# Altium project SoM BaseBoard Prototype V0.PrjPcb (part 2 of 2)

## Sheet Peripherals - MyoSensor.SchDoc
size 420 x 297 mm; SheetNumber: 6; SheetTotal: 7
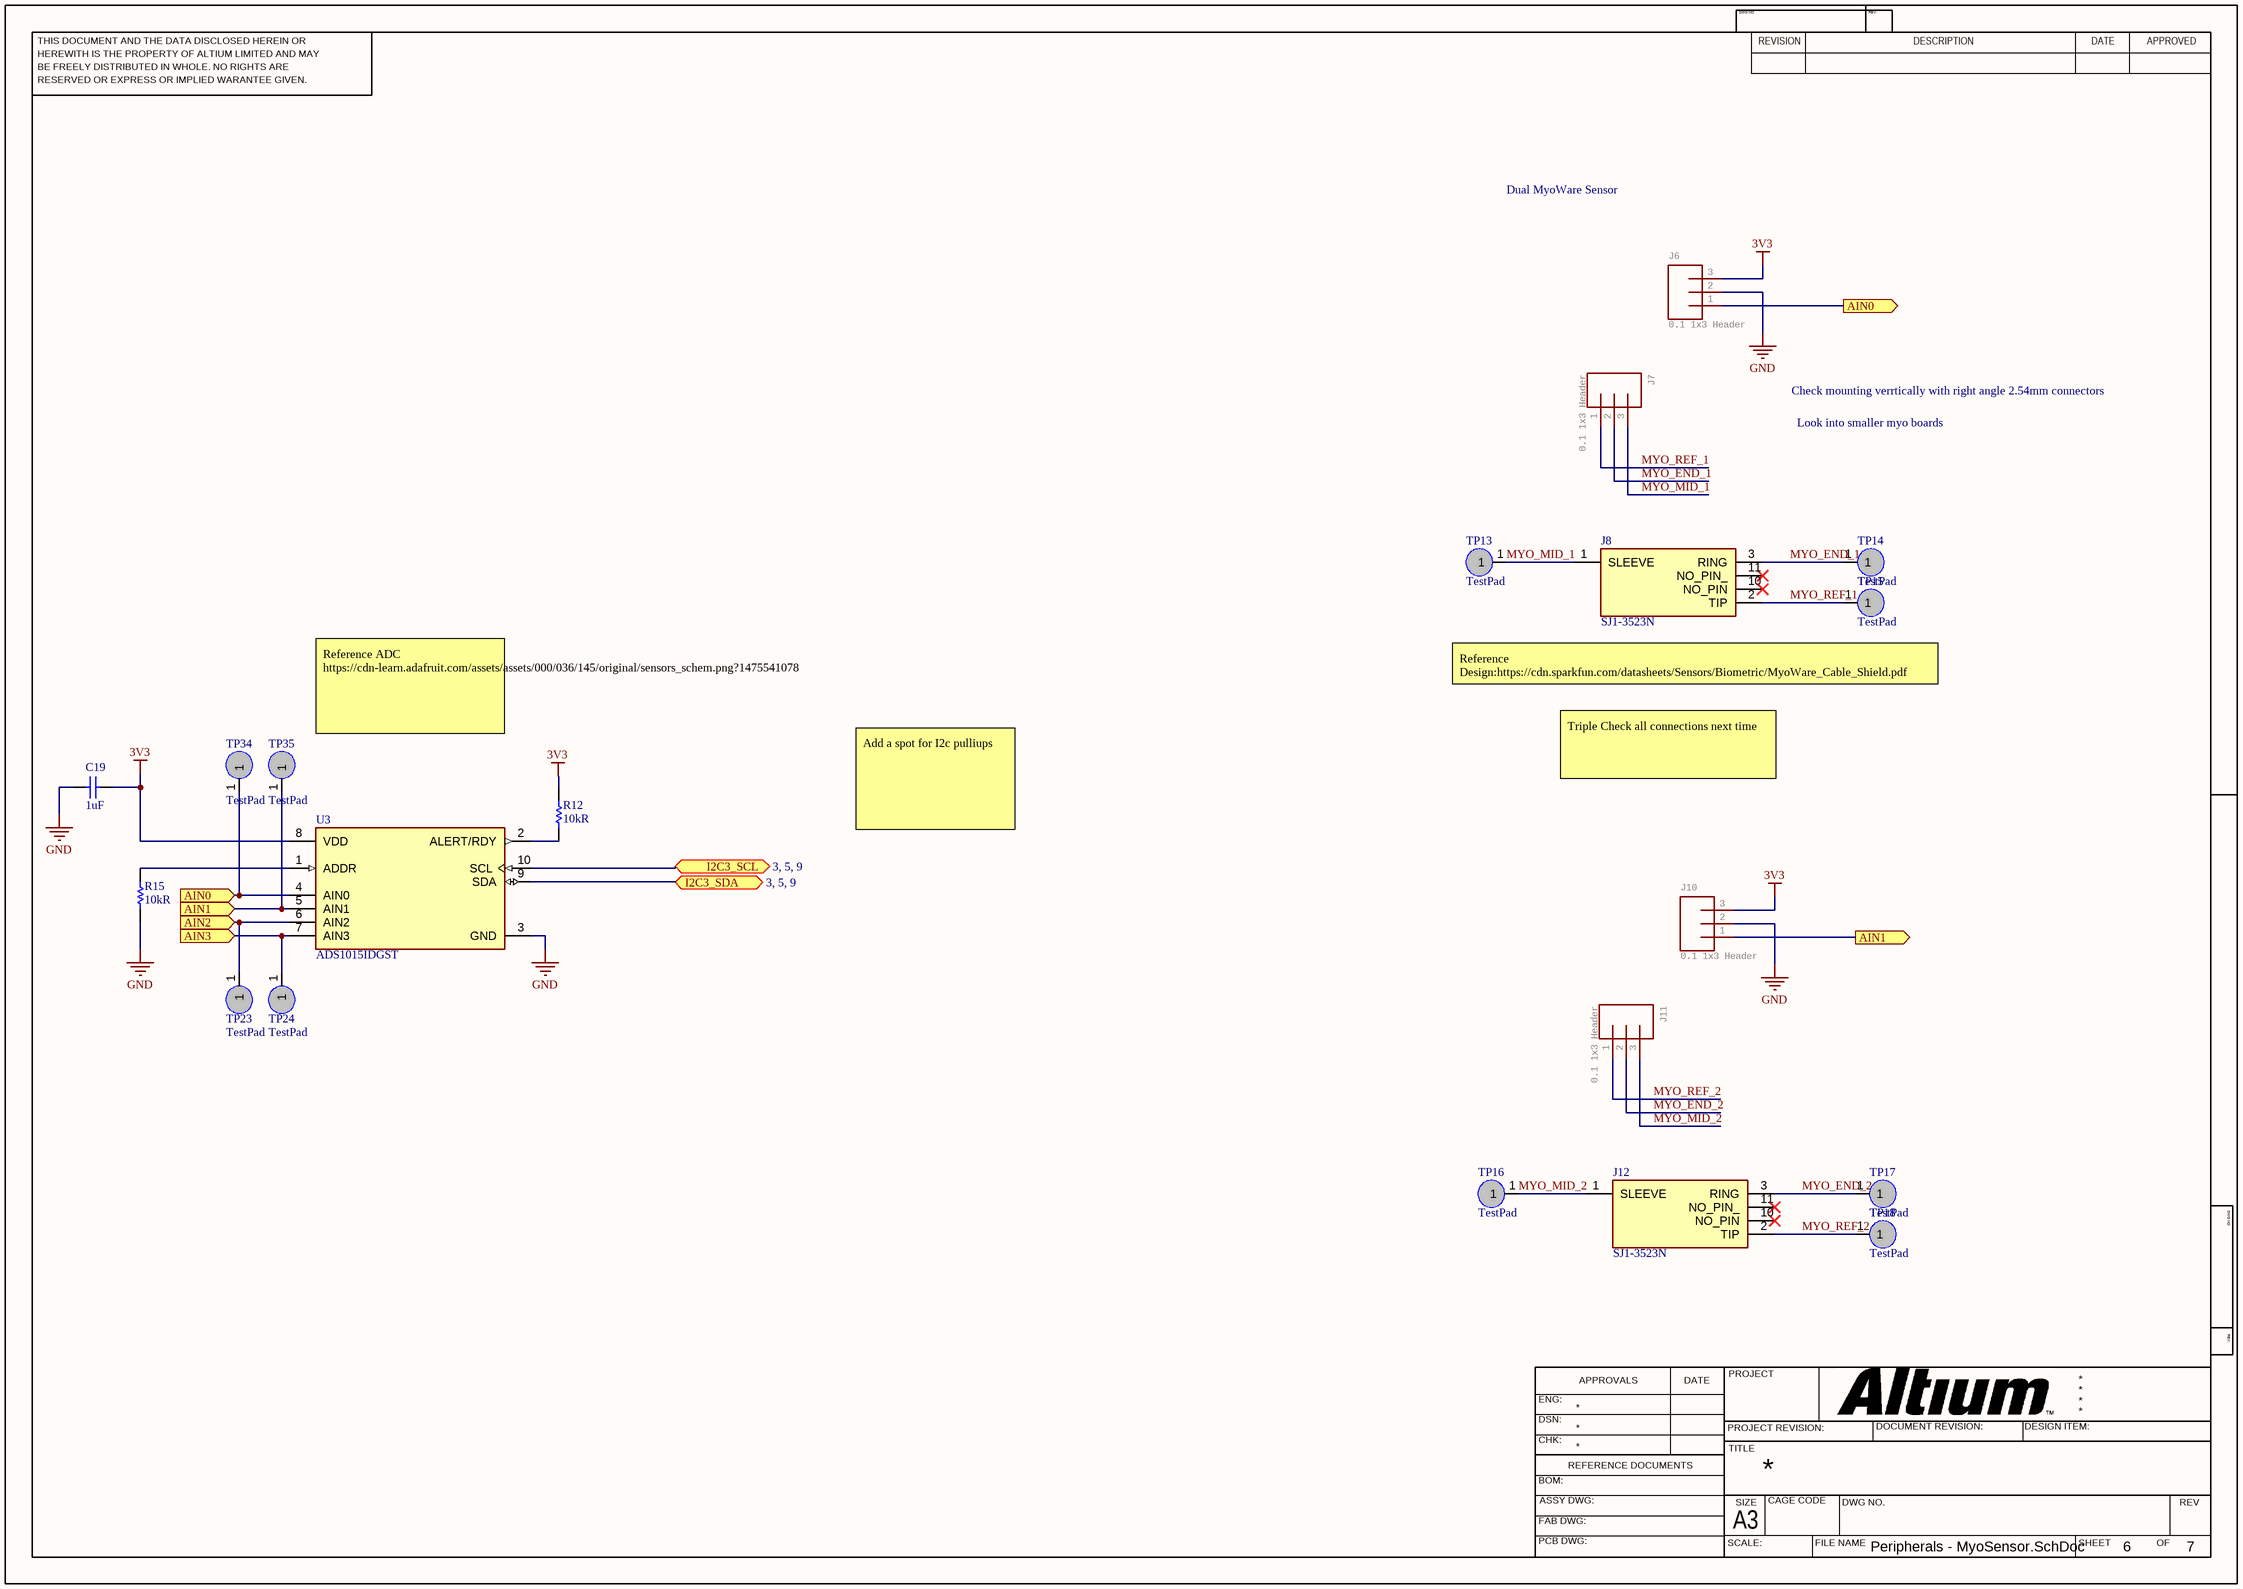
[diagram p5: Peripherals - MyoSensor.SchDoc]

### Parts
C19  1uF  [CAPC2013X145X50LL20T25]
J6  0.1 1x3 Header  [1X03]
J7  0.1 1x3 Header  [1X03]
J8  SJ1-3523N  [SJ13523N]
J10  0.1 1x3 Header  [1X03]
J11  0.1 1x3 Header  [1X03]
J12  SJ1-3523N  [SJ13523N]
R12  10kR  [RESC2013X60X35NL10T20]
R15  10kR  [RESC2013X60X35NL10T20]
TP13  TestPad  [TestPad50mil]
TP14  TestPad  [TestPad50mil]
TP15  TestPad  [TestPad50mil]
TP16  TestPad  [TestPad50mil]
TP17  TestPad  [TestPad50mil]
TP18  TestPad  [TestPad50mil]
TP23  TestPad  [TestPad50mil]
TP24  TestPad  [TestPad50mil]
TP34  TestPad  [TestPad50mil]
TP35  TestPad  [TestPad50mil]
U3  ADS1015IDGST  [FP-DGS0010A-MFG]

### Ports
AIN0 (in), AIN0 (out), AIN1 (in), AIN1 (out), AIN2 (in), AIN3 (in), I2C3_SCL (bidir, see 3, 5, 9), I2C3_SDA (bidir, see 3, 5, 9)

### Nets
3V3: C19.2 J6.3 J10.3 R12.2 U3.8(VDD)
GND: C19.1 J6.2 J10.2 R15.1 U3.3(GND)
I2C3_SCL: U3.10(SCL) ; port I2C3_SCL
I2C3_SDA: U3.9(SDA) ; port I2C3_SDA
MYO_END_1: J7.2 J8.3(RING) TP14.1
MYO_END_2: J11.2 J12.3(RING) TP17.1
MYO_MID_1: J7.3 J8.1(SLEEVE) TP13.1
MYO_MID_2: J11.3 J12.1(SLEEVE) TP16.1
MYO_REF_1: J7.1 J8.2(TIP) TP15.1
MYO_REF_2: J11.1 J12.2(TIP) TP18.1
NetJ6_1: J6.1 TP34.1 U3.4(AIN0) ; port AIN0
NetJ10_1: J10.1 TP35.1 U3.5(AIN1) ; port AIN1
NetR12_1: R12.1 U3.2(ALERT/RDY)
NetR15_2: R15.2 U3.1(ADDR)
NetTP23_1: TP23.1 U3.6(AIN2) ; port AIN2
NetTP24_1: TP24.1 U3.7(AIN3) ; port AIN3

Not connected (* = marked no-connect by the designer): J8 10(NO_PIN)* 11(NO_PIN_)*; J12 10(NO_PIN)* 11(NO_PIN_)*

### Notes on the sheet
- Dual MyoWare Sensor
- Check mounting verrtically with right angle 2.54mm connectors
- Look into smaller myo boards
- Reference ADC
  https://cdn-learn.adafruit.com/assets/assets/000/036/145/original/sensors_schem.png?1475541078
- Reference Design:https://cdn.sparkfun.com/datasheets/Sensors/Biometric/MyoWare_Cable_Shield.pdf
- Triple Check all connections next time
- Add a spot for I2c pulliups
- THIS DOCUMENT AND THE DATA DISCLOSED HEREIN OR
- HEREWITH IS THE PROPERTY OF ALTIUM LIMITED AND MAY
- DWG NO:
- REVISION
- REV:
- DESCRIPTION
- DATE
- APPROVED
- BE FREELY DISTRIBUTED IN WHOLE. NO RIGHTS ARE
- RESERVED OR EXPRESS OR IMPLIED WARANTEE GIVEN.
- ENG:
- APPROVALS
- PROJECT
- DSN:
- CHK:
- REFERENCE DOCUMENTS
- PROJECT REVISION:
- TITLE
- DOCUMENT REVISION:
- DESIGN ITEM:
- BOM:
- FAB DWG:
- PCB DWG:
- ASSY DWG:
- SCALE:
- A3
- SIZE
- CAGE CODE
- FILE NAME
- DWG NO.
- SHEET
- OF
- REV

### Library data of the parts
C19 = CMP-1036-04746-2: C0805C105K4PACTU; Manufacturer: Kemet; Part Number: C0805C105K4PACTU
J6 J7 J10 J11 = CONN_03: GateName_1: J$1; PROD_ID: XXX-00000; SymbolName_1: CONN_03; LibraryName: SparkFun-Connectors; DeviceSetName: CONN_03; Package: 1X03
J8 J12 = SJ1-3523N: Connector; Manufacturer_Name: CUI Inc.; Datasheet Link: https://componentsearchengine.com/Datasheets/1/SJ1-3523N.pdf; Height: 5.5mm; Manufacturer_Part_Number: SJ1-3523N; Mouser Part Number: 490-SJ1-3523N; Mouser Price/Stock: https://www.mouser.co.uk/ProductDetail/CUI-Devices/SJ1-3523N?qs=WyjlAZoYn50aNl0vAhb3Tg%3D%3D; Arrow Part Number: SJ1-3523N; Arrow Price/Stock: https://www.arrow.com/en/products/sj1-3523n/cui-devices
R12 R15 = CMP-1659-00013-4: RC0805FR-0710KL Chip Resistor, 10 KOhm, +/- 1%, 0.125 W, -55 to 155 degC, 0805 (2012 Metric), RoHS, Tape and Reel; Manufacturer: Yageo; Voltage Rating: 150 V; Mount: Surface Mount; ComponentLink1Description: Manufacturer URL; ComponentLink2URL: http://www.yageo.com/documents/recent/PYu-RC_Group_51_RoHS_L_04.pdf; Pins: 2; Length: 2 mm; Min Operating Temperature: -55 degC; Height: 0.5 mm; Mounting Technology: Surface Mount; RoHSCompliant: true; REACH SVHC: No SVHC; ComponentLink1URL: http://www.yageo.com/; Max Operating Temperature: 155 degC; PackageReference: 0805; DatasheetVersion: Rev. 4, 02/2016; Package Quantity: 5000; Packaging: Tape and Reel; ComponentLink2Description: Datasheet; PackageDescription: 2-Pin Surface Mounted Device, Body 2 x 1.25 mm
U3 = CMP-0003-00377-3: IC ADC 12BIT SIGMA-DELTA 10VSSOP; Supply Type: Single; Number of Converters: 1; Number of Bits: 12; Number of Inputs: 4; Sampling Rate: 3.3KS/s; Conversion Rate: 3300S/s; Min Supply Voltage: 2V; Interface: I2C; Operating Supply Voltage: 3.3V; Polarity: Bipolar; Nominal Supply Current: 150uA; Integral Nonlinearity (INL): 0.5LSB; Max Power Dissipation: 900uW; Max Supply Voltage (DC): 5.5V; Resolution: 12b; Width: 3mm; Min Operating Temperature: -40°C; Contact Plating: Gold; Number of A/D Converters: 1; Max Operating Temperature: 125°C; Height: 1.02mm; Case/Package: VSSOP; Package Quantity: 250; Number of Elements: 1; Lead Free: Lead Free; Number of Pins: 10; Radiation Hardening: No; Termination: SMD/SMT; Length: 3mm; Min Supply Voltage (DC): 2V; Power Dissipation: 900uW; Number of Channels: 4; Max Supply Voltage: 5.5V; REACH SVHC: No SVHC; Packaging: Tape and Reel

## Sheet Peripherals - Servos.SchDoc
size 420 x 297 mm; SheetNumber: 7; SheetTotal: 7
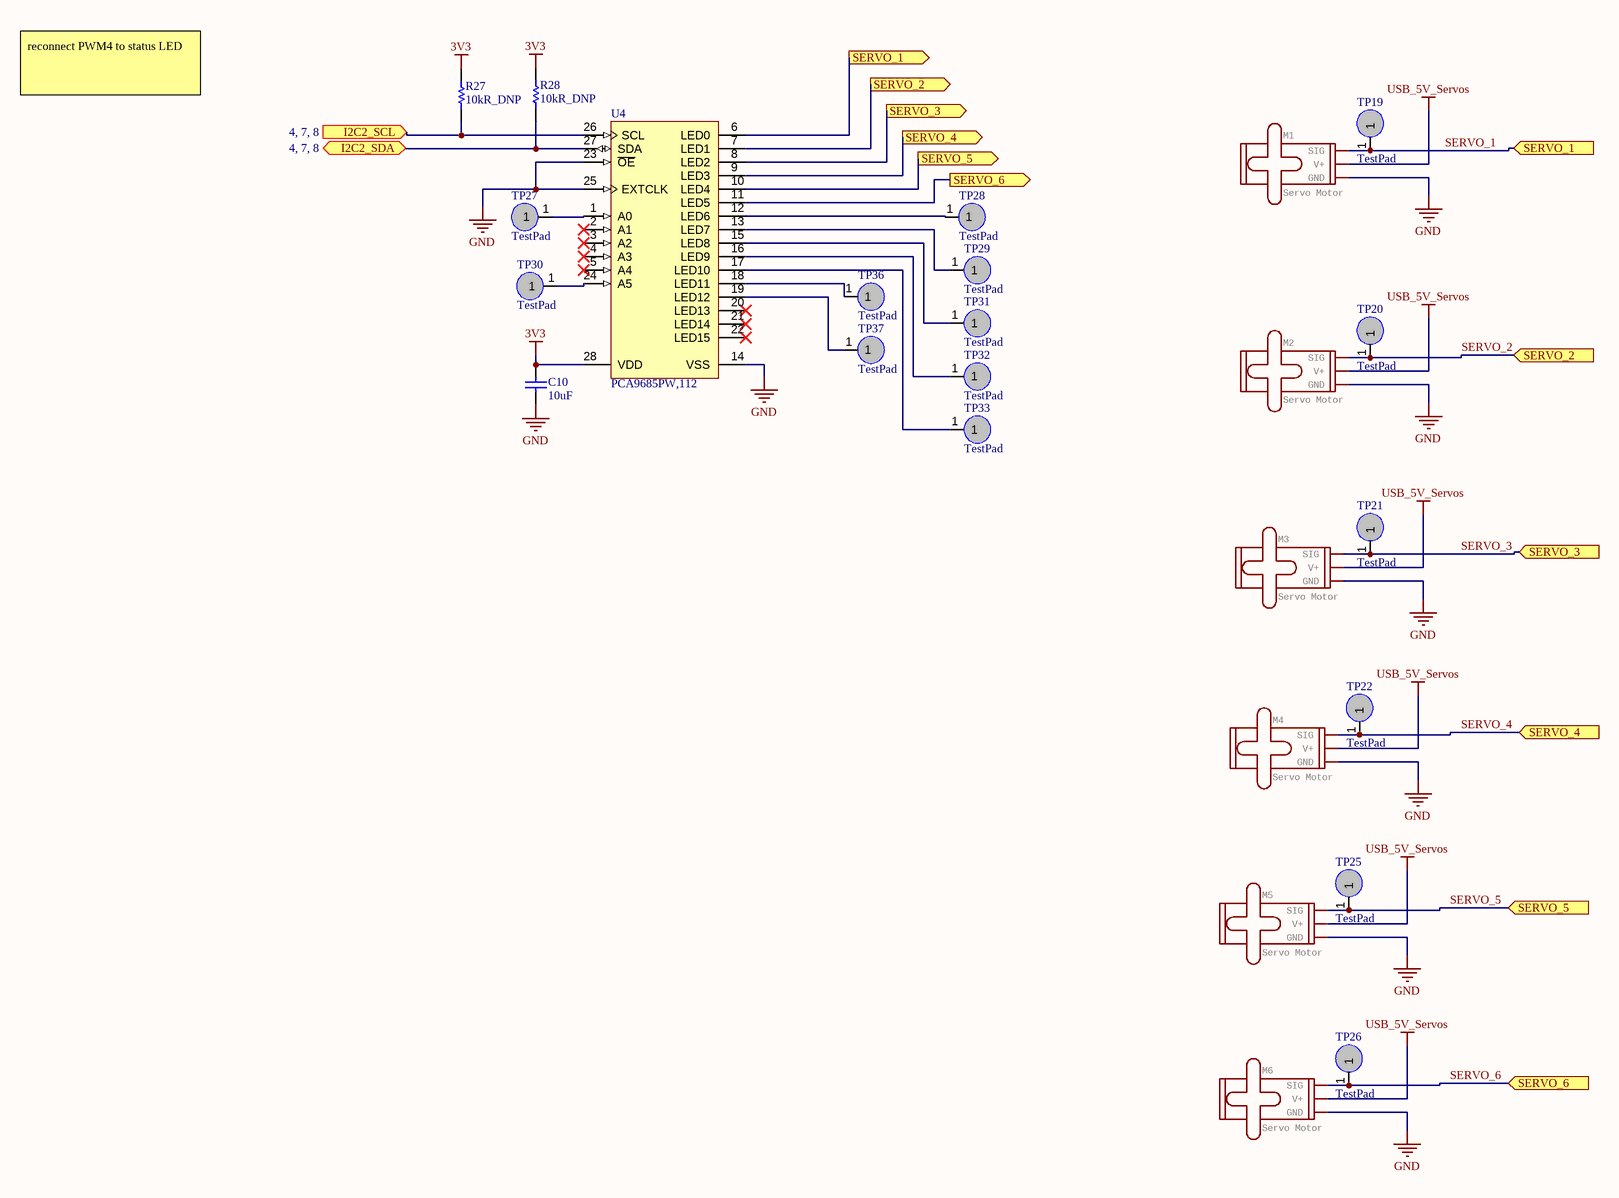
[diagram p6: Peripherals - Servos.SchDoc]

### Parts
C10  10uF  [CAPC2013X145X20ML20]
M1  Servo Motor  [1X03]
M2  Servo Motor  [1X03]
M3  Servo Motor  [1X03]
M4  Servo Motor  [1X03]
M5  Servo Motor  [1X03]
M6  Servo Motor  [1X03]
R27  10kR_DNP  [RESC2013X60X35NL10T20]
R28  10kR_DNP  [RESC2013X60X35NL10T20]
TP19  TestPad  [TestPad50mil]
TP20  TestPad  [TestPad50mil]
TP21  TestPad  [TestPad50mil]
TP22  TestPad  [TestPad50mil]
TP25  TestPad  [TestPad50mil]
TP26  TestPad  [TestPad50mil]
TP27  TestPad  [TestPad50mil]
TP28  TestPad  [TestPad50mil]
TP29  TestPad  [TestPad50mil]
TP30  TestPad  [TestPad50mil]
TP31  TestPad  [TestPad50mil]
TP32  TestPad  [TestPad50mil]
TP33  TestPad  [TestPad50mil]
TP36  TestPad  [TestPad50mil]
TP37  TestPad  [TestPad50mil]
U4  PCA9685PW,112  [SOT361-1_V]

### Ports
I2C2_SCL (in, see 4, 7, 8), I2C2_SDA (bidir, see 4, 7, 8), SERVO_1 (in), SERVO_1 (out), SERVO_2 (in), SERVO_2 (out), SERVO_3 (in), SERVO_3 (out), SERVO_4 (in), SERVO_4 (out), SERVO_5 (in), SERVO_5 (out), SERVO_6 (in), SERVO_6 (out)

### Nets
3V3: C10.2 R27.1 R28.1 U4.28(VDD)
GND: C10.1 M1.3(GND) M2.3(GND) M3.3(GND) M4.3(GND) M5.3(GND) M6.3(GND) U4.14(VSS) U4.23(~{OE}) U4.25(EXTCLK)
USB_5V_Servos: M1.2(V+) M2.2(V+) M3.2(V+) M4.2(V+) M5.2(V+) M6.2(V+)
I2C2_SCL: R27.2 U4.26(SCL) ; port I2C2_SCL
I2C2_SDA: R28.2 U4.27(SDA) ; port I2C2_SDA
SERVO_1: M1.1(SIG) TP19.1 U4.6(LED0) ; port SERVO_1
SERVO_2: M2.1(SIG) TP20.1 U4.7(LED1) ; port SERVO_2
SERVO_3: M3.1(SIG) TP21.1 U4.8(LED2) ; port SERVO_3
SERVO_4: M4.1(SIG) TP22.1 U4.9(LED3) ; port SERVO_4
SERVO_5: M5.1(SIG) TP25.1 U4.10(LED4) ; port SERVO_5
SERVO_6: M6.1(SIG) TP26.1 U4.11(LED5) ; port SERVO_6
NetTP27_1: TP27.1 U4.1(A0)
NetTP28_1: TP28.1 U4.12(LED6)
NetTP29_1: TP29.1 U4.13(LED7)
NetTP30_1: TP30.1 U4.24(A5)
NetTP31_1: TP31.1 U4.15(LED8)
NetTP32_1: TP32.1 U4.16(LED9)
NetTP33_1: TP33.1 U4.17(LED10)
NetTP36_1: TP36.1 U4.18(LED11)
NetTP37_1: TP37.1 U4.19(LED12)

Not connected (* = marked no-connect by the designer): U4 2(A1)* 3(A2)* 4(A3)* 5(A4)* 20(LED13)* 21(LED14)* 22(LED15)*

### Notes on the sheet
- reconnect PWM4 to status LED
- THIS DOCUMENT AND THE DATA DISCLOSED HEREIN OR
- HEREWITH IS THE PROPERTY OF ALTIUM LIMITED AND MAY
- DWG NO:
- REVISION
- REV:
- DESCRIPTION
- DATE
- APPROVED
- BE FREELY DISTRIBUTED IN WHOLE. NO RIGHTS ARE
- RESERVED OR EXPRESS OR IMPLIED WARANTEE GIVEN.
- ENG:
- APPROVALS
- PROJECT
- DSN:
- CHK:
- REFERENCE DOCUMENTS
- PROJECT REVISION:
- TITLE
- DOCUMENT REVISION:
- DESIGN ITEM:
- BOM:
- FAB DWG:
- PCB DWG:
- ASSY DWG:
- SCALE:
- A3
- SIZE
- CAGE CODE
- FILE NAME
- DWG NO.
- SHEET
- OF
- REV

### Library data of the parts
C10 = CMP-2000-05452-1: C2012X7R1A106K125AC Multilayer Ceramic Chip Capacitor, 10 uF, +/- 10%, 10 V, -55 to 125 degC, 0805 (2012 Metric), RoHS, Tape and Reel; Manufacturer: TDK; PCN Part Number: MLCCPartNumberChange30/Nov/2012; Capacitance: 10µF; Voltage - Rated: 10V; Product Training Modules: CSeriesGeneralApplicationsSEAT,CCV,andTVCLDesignToolsGuidetoReplacinganElectrolyticCapacitorwithanMLCC; Online Catalog: CSeries,GeneralPurpose; Other Names: 445-6857-6; Temperature Coefficient: X7R; Features: -; Ratings: -; Operating Temperature: -55degC~125degC; RoHS Information: RoHSCertificate-MLCC; Datasheet Version: Mar-15; Package / Case: 0805(2012Metric); Series: C; Mounting Type: SurfaceMount,MLCC; Family: CeramicCapacitors; Height - Seated (Max): -; Manufacturer URL: http://www.tdk.com/; Packaging: Digi-Reel; Tolerance: ±10%; Category: Capacitors; Applications: GeneralPurpose; Standard Package: 1; Size / Dimension: 0.079"Lx0.049"W(2.00mmx1.25mm); Datasheet URL: http://download.siliconexpert.com/pdfs/2015/4/21/15/54/45/779/tdk_/manual/37024850441143360mlcc_commercial_general_en.pdf; Lead Style: -; Lead Spacing: -; Thickness (Max): 0.057"(1.45mm); Package Reference: 805; Package Description: 2-Pin Surface Mount Device, Body 2 x 1.25 mm
M1-M6 = SERVO: GateName_1: G$1; SymbolName_1: SMALL_SERVO_MOTOR; LibraryName: SparkFun-Electromechanical; DeviceSetName: SERVO; Package: 1X03
R27 R28 = CMP-1659-00013-4: as R12 on sheet Peripherals - MyoSensor; Mount: Surface Mount; ComponentLink1Description: Manufacturer URL; ComponentLink2URL: http://www.yageo.com/documents/recent/PYu-RC_Group_51_RoHS_L_04.pdf; Pins: 2; Length: 2 mm; Min Operating Temperature: -55 degC; Height: 0.5 mm; Mounting Technology: Surface Mount; RoHSCompliant: true; REACH SVHC: No SVHC; ComponentLink1URL: http://www.yageo.com/; Max Operating Temperature: 155 degC; PackageReference: 0805; DatasheetVersion: Rev. 4, 02/2016; Package Quantity: 5000; Packaging: Tape and Reel; ComponentLink2Description: Datasheet; PackageDescription: 2-Pin Surface Mounted Device, Body 2 x 1.25 mm
U4 = CMP-1595-00004-2: 16-Channel, 12-Bit PWM Fm+ I2C-Bus LED Controller, 2.3 to 5.5 V, -40 to 85 degC, 28-Pin TSSOP (SOT361-1), RoHS, Tape and Reel; Supply Current Max: 10 mA; Supply Voltage Min: 2.3 V; Supply Voltage Max: 5.5 V; Frequency: 25000000 Hz; Temperature Min: -40 degC; PackageDescription: 28-Pin Small Outline Package, Body 9.7 x 4.4 mm, Pitch 0.65 mm; RoHS: TRUE; ComponentLink1Description: Manufacturer URL; Code_JEDEC: MO-153; PartNumber: PCA9685; ComponentLink2URL: http://www.nxp.com/documents/data_sheet/PCA9685.pdf; Packing: Tape and Reel; ComponentLink1URL: http://www.nxp.com/; ComponentLink3Description: Package Specification; ComponentLink2Description: Datasheet; ComponentLink3URL: http://www.nxp.com/documents/outline_drawing/sot361-1_po.pdf; DatasheetVersion: Rev. 4; Temperature Max: 85 degC; PackageVersion: 02/2003; Mounting Technology: Surface Mount

## Sheet Peripherals - Feature Creep.SchDoc
size 420 x 297 mm; SheetNumber: 8; SheetTotal: 8
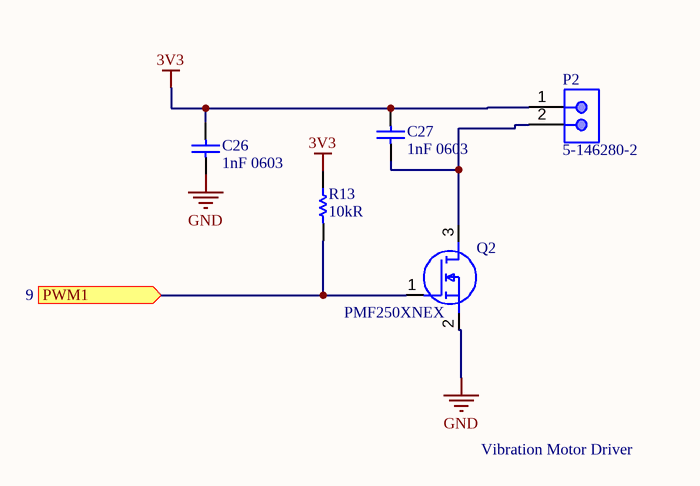
[diagram p7: Peripherals - Feature Creep.SchDoc]

### Parts
C26  1nF 0603  [CAPC1608X90X35LL15T15]
C27  1nF 0603  [CAPC1608X90X35LL15T15]
P2  5-146280-2  [TECO-5-146280-2_V]
Q2  PMF250XNEX  [SOT65P210X110-3N]
R13  10kR  [RESC2013X60X35NL10T20]

### Ports
PWM1 (in, see 9)

### Nets
3V3: C26.1 C27.1 P2.1 R13.1
GND: C26.2 Q2.2(S)
NetC27_2: C27.2 P2.2 Q2.3(D)
NetJ1312_88: Q2.1(G) R13.2 ; port PWM1

### Notes on the sheet
- Vibration Motor Driver
- THIS DOCUMENT AND THE DATA DISCLOSED HEREIN OR
- HEREWITH IS THE PROPERTY OF ALTIUM LIMITED AND MAY
- DWG NO:
- REVISION
- REV:
- DESCRIPTION
- DATE
- APPROVED
- BE FREELY DISTRIBUTED IN WHOLE. NO RIGHTS ARE
- RESERVED OR EXPRESS OR IMPLIED WARANTEE GIVEN.
- ENG:
- APPROVALS
- PROJECT
- DSN:
- CHK:
- REFERENCE DOCUMENTS
- PROJECT REVISION:
- TITLE
- DOCUMENT REVISION:
- DESIGN ITEM:
- BOM:
- FAB DWG:
- PCB DWG:
- ASSY DWG:
- SCALE:
- A3
- SIZE
- CAGE CODE
- FILE NAME
- DWG NO.
- SHEET
- OF
- REV

### Library data of the parts
C26 C27 = CMP-2006-04378-1: 06035C102KAT2A; Manufacturer: AVX Interconnect / Elco; Part Number: 06035C102KAT2A
P2 = CMP-2000-07492-1: Male Header, Pitch 2.54 mm, 1 x 2 Position, Height 8.21 mm, Tail Length 3.05 mm, -65 to 105 degC, RoHS, Bulk; Manufacturer: TE Connectivity; Mating Connector Lock: No(Without); Number of Positions: 2; Pitch: 2.54mm; PCB Mounting Orientation: Vertical; Keyed: No; Case\/Package: 100; Mating Post Length: 0.23inch; High Temperature Housing: Yes; Max Current Rating: 5A; PCB Thickness: 0.063inch; PCB Mount Retention: Without; Approvals: CSA; Current Rating: 3A; Radiation Hardening: No; Length: 4.67mm; Contact Mating Length: 0.23inch; Connector Type: Header; Number of Rows: 1; Termination Post Length: 0.12inch; Board Standoff: No(Without); Max Operating Temperature: 105degC; Contact Shape: Square; Selectively Loaded: No(Without); Gasket: No(Without); Number of Contacts: 2; Contact Gender: Male; Mating Alignment: No(Without); Manufacturer URL: http://www.te.com/; Datasheet URL: http://www.te.com/commerce/DocumentDelivery/DDEController?Action=showdoc&DocId=Customer+Drawing%7F146280%7FH1%7Fpdf%7FEnglish%7FENG_CD_146280_H1.pdf%7F5-146280-2; Mount: ThroughHole; Orientation: Straight; Packaging: Carton; Package Reference: 5-146280-2; Package Quantity: 500; Stabilizers: No(Without); Row Spacing: 2.54mm; Contact Material: CopperAlloy; Panel Mount Retention: No(Without); Datasheet Version: Rev. H1, 08/2016; Housing Colour: Black; Colour: Black; Package Description: Male Header, Pitch 2.54 mm, 1 x 2 Position, Height 8.21 mm, Tail Length 3.05 mm; Contact Plating: Matte; Housing Material: Polymer; Contact Protection: No(Without); Min Operating Temperature: -65degC; Mounting Technology: ThroughHole; Flammability Rating: UL94V-0; RoHSCompliant: true; Termination: ThroughHole; Depth: 2.34mm; High Speed Serial Data Connector: No
Q2 = PMF250XNEX: MOSFET (N-Channel); Manufacturer_Name: Nexperia; Datasheet Link: https://assets.nexperia.com/documents/data-sheet/PMF250XNE.pdf; Height: 1.1mm; Manufacturer_Part_Number: PMF250XNEX; Mouser Part Number: 771-PMF250XNEX; Mouser Price/Stock: https://www.mouser.co.uk/ProductDetail/Nexperia/PMF250XNEX?qs=gH1BdSMZm8Un6H8hz1cFsw%3D%3D; Arrow Part Number: PMF250XNEX; Arrow Price/Stock: https://www.arrow.com/en/products/pmf250xnex/nexperia
R13 = CMP-1659-00013-4: as R12 on sheet Peripherals - MyoSensor; Mount: Surface Mount; ComponentLink1Description: Manufacturer URL; ComponentLink2URL: http://www.yageo.com/documents/recent/PYu-RC_Group_51_RoHS_L_04.pdf; Pins: 2; Length: 2 mm; Min Operating Temperature: -55 degC; Height: 0.5 mm; Mounting Technology: Surface Mount; RoHSCompliant: true; REACH SVHC: No SVHC; ComponentLink1URL: http://www.yageo.com/; Max Operating Temperature: 155 degC; PackageReference: 0805; DatasheetVersion: Rev. 4, 02/2016; Package Quantity: 5000; Packaging: Tape and Reel; ComponentLink2Description: Datasheet; PackageDescription: 2-Pin Surface Mounted Device, Body 2 x 1.25 mm

## Nets that join several sheets
3V3: SoM (9 pins), SoM - PullUp PullDown (R31.1 R32.1 R35.1 R36.1), Power (C2.1 L1.2 TP7.1 U1.4), Peripherals - MyoSensor (5 pins), Peripherals - Servos (C10.2 R27.1 R28.1 U4.28), Peripherals - Feature Creep (C26.1 C27.1 P2.1 R13.1)
5VSYS: SoM (16 pins), Power (12 pins), Peripherals - USB (6 pins)
GND: SoM (92 pins), SoM - PullUp PullDown (R33.2 R34.2 R37.2 R38.2), Power (33 pins), Peripherals - USB (9 pins), Peripherals - MyoSensor (5 pins), Peripherals - Servos (10 pins), Peripherals - Feature Creep (C26.2 Q2.2)
USB_5V_Servos: Power (8 pins), Peripherals - Servos (6 pins)
GPIO6: SoM (J1.13 J1312.49), SoM - PullUp PullDown (R35.2 R37.1)
I2C2_SCL: SoM (J1.5 J1311.87), Peripherals - Servos (R27.2 U4.26)
I2C2_SDA: SoM (J1.3 J1311.85), Peripherals - Servos (R28.2 U4.27)
I2C3_SCL: SoM (J1.28 J1311.83), Peripherals - MyoSensor (U3.10)
I2C3_SDA: SoM (J1.27 J1311.81), Peripherals - MyoSensor (U3.9)
NetJ1312_88: SoM (J1312.88), Peripherals - Feature Creep (Q2.1 R13.2)
nUSBFault: SoM (J1312.90), Peripherals - USB (R9.1 U2.4)
PWM3: SoM (J1.15 J1312.92), SoM - PullUp PullDown (R36.2 R38.1)
UART3_RXD: SoM (J1.11 J1311.97), SoM - PullUp PullDown (R32.2 R34.1)
UART3_TXD: SoM (J1.7 J1311.91), SoM - PullUp PullDown (R31.2 R33.1)
USB2_D_N: SoM (J1311.65), Peripherals - USB (J4.2)
USB2_D_P: SoM (J1311.63), Peripherals - USB (J4.3)